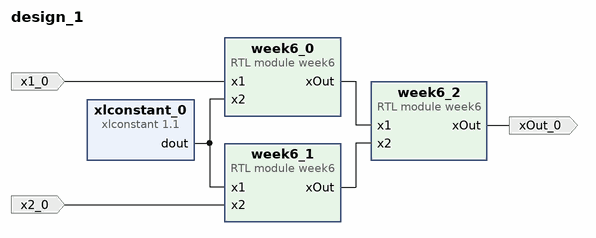
[diagram p0: block diagram of the top level]
# Vivado block design design_1, xc7a100tcsg324-2, Vivado 2022.2
create_bd_design design_1

create_bd_port -dir O xOut_0
create_bd_port -dir I x1_0
create_bd_port -dir I x2_0

create_bd_cell -type ip -vlnv xilinx.com:ip:xlconstant:1.1 xlconstant_0
set_property -dict {CONFIG.CONST_WIDTH 1} [get_bd_cells xlconstant_0]
create_bd_cell -type module -reference week6 week6_0
create_bd_cell -type module -reference week6 week6_1
create_bd_cell -type module -reference week6 week6_2

# ---- connections ----

connect_bd_net [get_bd_pins week6_0/xOut] [get_bd_pins week6_2/x1]
connect_bd_net [get_bd_pins week6_1/xOut] [get_bd_pins week6_2/x2]
connect_bd_net [get_bd_pins week6_2/xOut] [get_bd_ports xOut_0]
connect_bd_net -net x1_0_1 [get_bd_ports x1_0] [get_bd_pins week6_0/x1]
connect_bd_net -net x2_0_1 [get_bd_ports x2_0] [get_bd_pins week6_1/x2]
connect_bd_net [get_bd_pins xlconstant_0/dout] [get_bd_pins week6_0/x2] [get_bd_pins week6_1/x1]

validate_bd_design
save_bd_design
